# EAGLE design rapide328 (EAGLE 5.11)
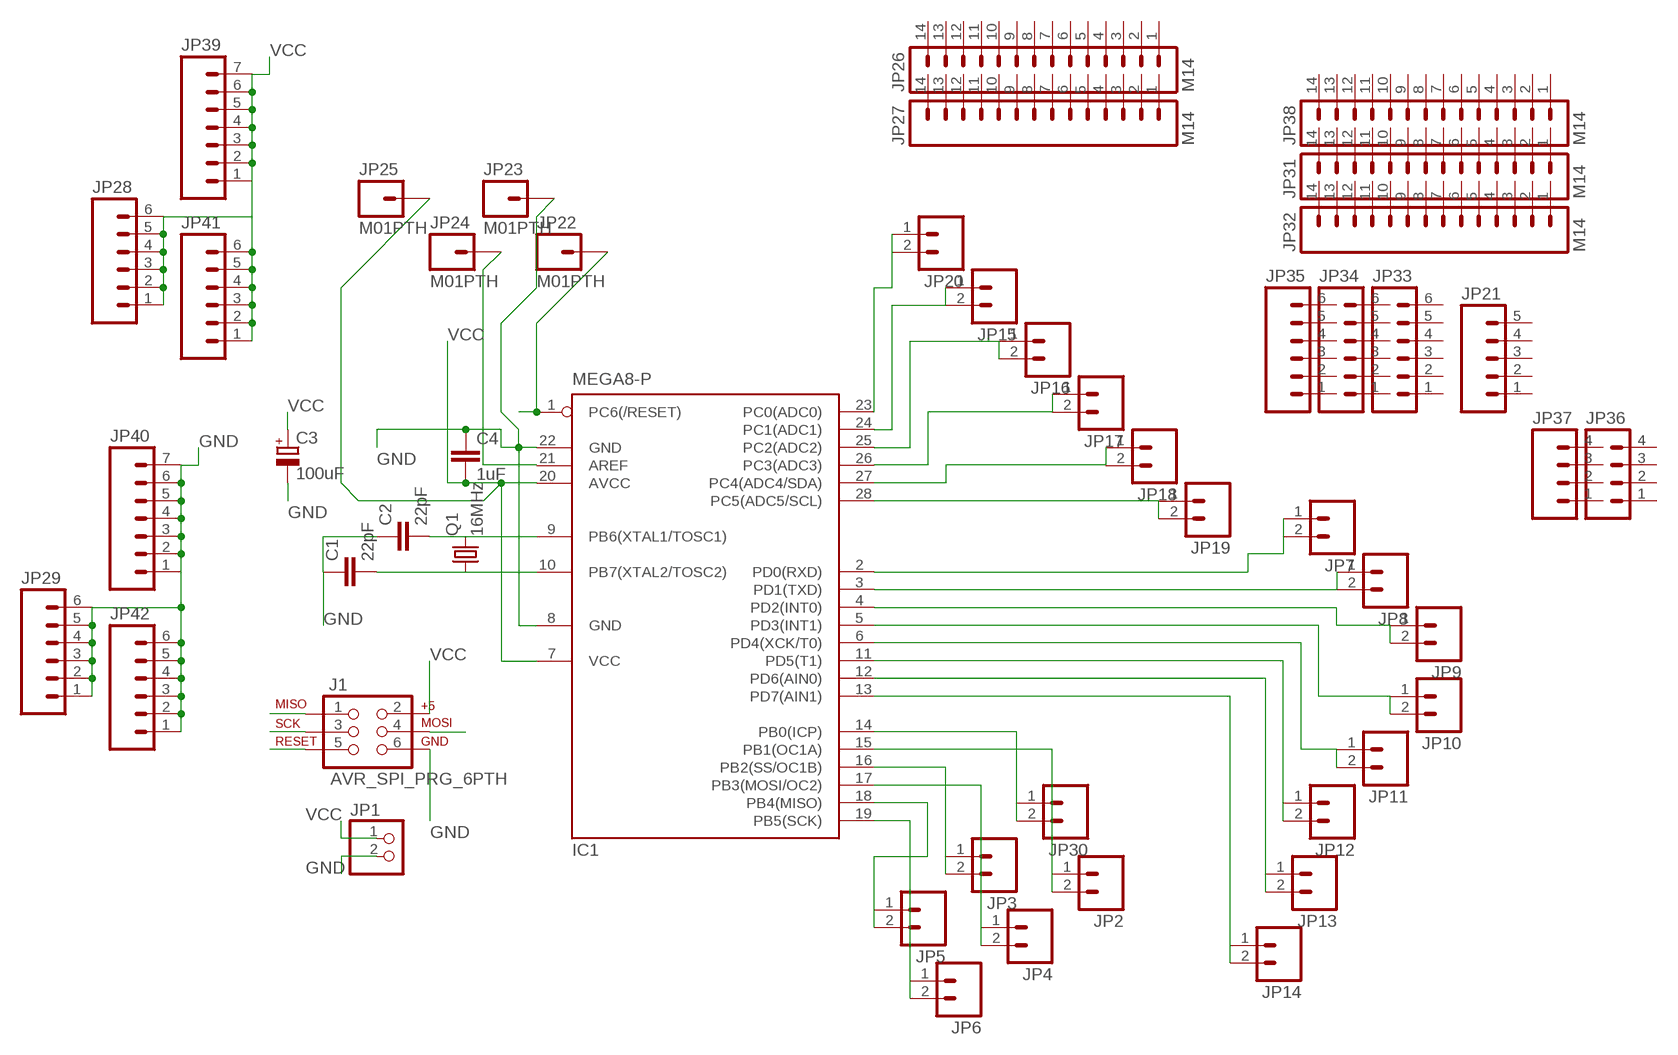
[diagram p0: schematic, sheet 1]

## Parts
C1  22pF  C-EU025-024X044  [C025-024X044]
C2  22pF  C-EU025-024X044  [C025-024X044]
C3  100uF  CPOL-EUE2.5-5  [E2,5-5]
C4  1uF  C-EU025-024X044  [C025-024X044]
IC1  MEGA8-P  [DIL28-3]
J1  AVR_SPI_PRG_6PTH  [2X3]
JP1  PINHD-1X2  [1X02]
JP2  M02LOCK  [1X02_LOCK]
JP3  M02LOCK  [1X02_LOCK]
JP4  M02LOCK  [1X02_LOCK]
JP5  M02LOCK  [1X02_LOCK]
JP6  M02LOCK  [1X02_LOCK]
JP7  M02LOCK  [1X02_LOCK]
JP8  M02LOCK  [1X02_LOCK]
JP9  M02LOCK  [1X02_LOCK]
JP10  M02LOCK  [1X02_LOCK]
JP11  M02LOCK  [1X02_LOCK]
JP12  M02LOCK  [1X02_LOCK]
JP13  M02LOCK  [1X02_LOCK]
JP14  M02LOCK  [1X02_LOCK]
JP15  M02LOCK  [1X02_LOCK]
JP16  M02LOCK  [1X02_LOCK]
JP17  M02LOCK  [1X02_LOCK]
JP18  M02LOCK  [1X02_LOCK]
JP19  M02LOCK  [1X02_LOCK]
JP20  M02LOCK  [1X02_LOCK]
JP21  M05PTH  [1X05]
JP22  M01PTH  [1X01]
JP23  M01PTH  [1X01]
JP24  M01PTH  [1X01]
JP25  M01PTH  [1X01]
JP26  M14  [1X14]
JP27  M14  [1X14]
JP28  M06SIP  [1X06]
JP29  M06SIP  [1X06]
JP30  M02LOCK  [1X02_LOCK]
JP31  M14  [1X14]
JP32  M14  [1X14]
JP33  M06SIP  [1X06]
JP34  M06SIP  [1X06]
JP35  M06SIP  [1X06]
JP36  M04PTH  [1X04]
JP37  M04PTH  [1X04]
JP38  M14  [1X14]
JP39  M07  [1X07]
JP40  M07  [1X07]
JP41  M06SIP  [1X06]
JP42  M06SIP  [1X06]
Q1  16MHz  CRYSTALHC49S  [HC49/S]

## Nets
GND: C1.1 C2.1 C3.- C4.1 IC1.8(GND) IC1.22(GND) J1.6 JP1.2 JP23.1 JP29.1 JP29.2 JP29.3 JP29.4 JP29.5 JP29.6 JP40.1 JP40.2 JP40.3 JP40.4 JP40.5 JP40.6 JP40.7 JP42.1 JP42.2 JP42.3 JP42.4 JP42.5 JP42.6
MISO: IC1.18(PB4(MISO)) J1.1 JP5.1 JP5.2
MOSI: IC1.17(PB3(MOSI/OC2)) J1.4 JP4.1 JP4.2
N$1: C1.2 IC1.10(PB7(XTAL2/TOSC2)) Q1.1
N$2: C2.2 IC1.9(PB6(XTAL1/TOSC1)) Q1.2
N$3: IC1.14(PB0(ICP)) JP30.1 JP30.2
N$4: IC1.15(PB1(OC1A)) JP2.1 JP2.2
N$5: IC1.16(PB2(SS/OC1B)) JP3.1 JP3.2
N$6: IC1.2(PD0(RXD)) JP7.1 JP7.2
N$7: IC1.3(PD1(TXD)) JP8.1 JP8.2
N$8: IC1.4(PD2(INT0)) JP9.1 JP9.2
N$9: IC1.27(PC4(ADC4/SDA)) JP18.1 JP18.2
N$10: IC1.28(PC5(ADC5/SCL)) JP19.1 JP19.2
N$11: IC1.26(PC3(ADC3)) JP17.1 JP17.2
N$12: IC1.5(PD3(INT1)) JP10.1 JP10.2
N$13: IC1.6(PD4(XCK/T0)) JP11.1 JP11.2
N$14: IC1.21(AREF) JP24.1
N$18: IC1.11(PD5(T1)) JP12.1 JP12.2
N$19: IC1.23(PC0(ADC0)) JP20.1 JP20.2
N$20: IC1.24(PC1(ADC1)) JP15.1 JP15.2
N$21: IC1.25(PC2(ADC2)) JP16.1 JP16.2
N$25: IC1.12(PD6(AIN0)) JP13.1 JP13.2
N$26: IC1.13(PD7(AIN1)) JP14.1 JP14.2
RESET: IC1.1(PC6(/RESET)) J1.5 JP22.1
SCK: IC1.19(PB5(SCK)) J1.3 JP6.1 JP6.2
VCC: C3.+ C4.2 IC1.7(VCC) IC1.20(AVCC) J1.2 JP1.1 JP25.1 JP28.1 JP28.2 JP28.3 JP28.4 JP28.5 JP28.6 JP39.1 JP39.2 JP39.3 JP39.4 JP39.5 JP39.6 JP39.7 JP41.1 JP41.2 JP41.3 JP41.4 JP41.5 JP41.6
Unconnected: JP21.1 JP21.2 JP21.3 JP21.4 JP21.5 JP26.1 JP26.2 JP26.3 JP26.4 JP26.5 JP26.6 JP26.7 JP26.8 JP26.9 JP26.10 JP26.11 JP26.12 JP26.13 JP26.14 JP27.1 JP27.2 JP27.3 JP27.4 JP27.5 JP27.6 JP27.7 JP27.8 JP27.9 JP27.10 JP27.11 JP27.12 JP27.13 JP27.14 JP31.1 JP31.2 JP31.3 JP31.4 JP31.5 JP31.6 JP31.7 JP31.8 JP31.9 JP31.10 JP31.11 JP31.12 JP31.13 JP31.14 JP32.1 JP32.2 JP32.3 JP32.4 JP32.5 JP32.6 JP32.7 JP32.8 JP32.9 JP32.10 JP32.11 JP32.12 JP32.13 JP32.14 JP33.1 JP33.2 JP33.3 JP33.4 JP33.5 JP33.6 JP34.1 JP34.2 JP34.3 JP34.4 JP34.5 JP34.6 JP35.1 JP35.2 JP35.3 JP35.4 JP35.5 JP35.6 JP36.1 JP36.2 JP36.3 JP36.4 JP37.1 JP37.2 JP37.3 JP37.4 JP38.1 JP38.2 JP38.3 JP38.4 JP38.5 JP38.6 JP38.7 JP38.8 JP38.9 JP38.10 JP38.11 JP38.12 JP38.13 JP38.14

## Library data of the parts
C1 C2 C4 = resistor:C-EU: CAPACITOR, European symbol
C3 = resistor:CPOL-EU: POLARIZED CAPACITOR, European symbol
IC1 = atmel:MEGA8-P: MICROCONTROLLER 8 Kbytes FLASH, 1 kbytes SRAM, 512 bytes EEPROM, USART, 4-channel 10 bit ADC, 2-channel 8 bit ADC Pin compatible with Atmega48, ATMega88, ATMega168 Source: avr.lbr; OC_FARNELL: unknown; OC_NEWARK: unknown
J1 = SparkFun:AVR_SPI_PRG_6: AVR ISP 6 Pin This is the reduced ISP connector for AVR programming. Common on Arduino. This footprint will take up less PCB space and can be used with a 10-pin to 6-pin adapter such as SKU: BOB-08508
JP1 = pinhead:PINHD-1X2: PIN HEADER
JP2-JP20 JP30 = SparkFun:M02: Header 2 Standard 2-pin 0.1" header. Use with straight break away headers (SKU : PRT-00116), right angle break away headers (PRT-00553), swiss pins (PRT-00743), machine pins (PRT-00117), and female headers (PRT-00115). Molex polarized connector foot print use with SKU : PRT-08233 with associated crimp pins and housings.
JP21 = SparkFun:M05: Header 5 Standard 5-pin 0.1" header. Use with straight break away headers (SKU : PRT-00116), right angle break away headers (PRT-00553), swiss pins (PRT-00743), machine pins (PRT-00117), and female headers (PRT-00115). Molex polarized connector foot print use with SKU : PRT-08230 with associated crimp pins and housings.
JP22-JP25 = SparkFun:M01: Header 1 Standard 1-pin 0.1" header. Use with straight break away headers (SKU : PRT-00116), right angle break away headers (PRT-00553), swiss pins (PRT-00743), machine pins (PRT-00117), and female headers (PRT-00115).
JP26 JP27 JP31 JP32 JP38 = SparkFun:M14: Header 14 Standard 14-pin 0.1" header. Use with straight break away headers (SKU : PRT-00116), right angle break away headers (PRT-00553), swiss pins (PRT-00743), machine pins (PRT-00117), and female headers (PRT-00115).
JP28 JP29 JP33-JP35 JP41 JP42 = SparkFun:M06: Header 6 Standard 6-pin 0.1" header. Use with straight break away headers (SKU : PRT-00116), right angle break away headers (PRT-00553), swiss pins (PRT-00743), machine pins (PRT-00117), and female headers (PRT-00115). Molex polarized connector foot print use with SKU : PRT-08094 with associated crimp pins and housings. NOTES ON THE VARIANTS LOCK and LOCK_LONGPADS... This footprint was designed to help hold the alignment of a through-hole component (i.e. 6-pin header) while soldering it into place. You may notice that each hole has been shifted either up or down by 0.005 of an inch from it's more standard position (which is a perfectly straight line). This slight alteration caused the pins (the squares in the middle) to touch the edges of the holes. Because they are alternating, it causes a "brace" to hold the component in place. 0.005 has proven to be the perfect amount of "off-center" position when using our standard breakaway headers. Although looks a little odd when you look at the bare footprint, once you have a header in there, the alteration is very hard to notice. Also, if you push a header all the way into place, it is covered up entirely on the bottom side. This idea of altering the position of holes to aid alignment will be further integrated into the Sparkfun Library for other footprints. It can help hold any component with 3 or more connection pins.
JP36 JP37 = SparkFun:M04: Header 4 Standard 4-pin 0.1" header. Use with straight break away headers (SKU : PRT-00116), right angle break away headers (PRT-00553), swiss pins (PRT-00743), machine pins (PRT-00117), and female headers (PRT-00115). Molex polarized connector foot print use with SKU : PRT-08231 with associated crimp pins and housings. 1MM SMD Version SKU: PRT-10208
JP39 JP40 = SparkFun:M07: Header 7 Standard 7-pin 0.1" header. Use with straight break away headers (SKU : PRT-00116), right angle break away headers (PRT-00553), swiss pins (PRT-00743), machine pins (PRT-00117), and female headers (PRT-00115). NOTES ON THE VARIANTS LOCK and LOCK_LONGPADS... This footprint was designed to help hold the alignment of a through-hole component (i.e. 7-pin header) while soldering it into place. You may notice that each hole has been shifted either up or down by 0.005 of an inch from it's more standard position (which is usually a perfectly straight line). This slight alteration caused the pins (the squares in the middle) to touch the edges of the holes. Because they are alternating, it causes a "brace" to hold the header in place. 0.005 has proven to be the perfect amount of "off-center" position when using our standard breakaway headers. Although looks a little odd when you look at the bare footprint, once you have a header in there, the alteration is very hard to notice. Also, if you push a header all the way into place, it is covered up entirely on the bottom side. This idea of altering the position of holes to aid alignment will be further integrated into the Sparkfun Library for other footprints. It can help hold any component with 3 or more connection pins.
Q1 = crystal:CRYSTAL: CRYSTAL; OC_FARNELL: 1667008; OC_NEWARK: unknown

## Board
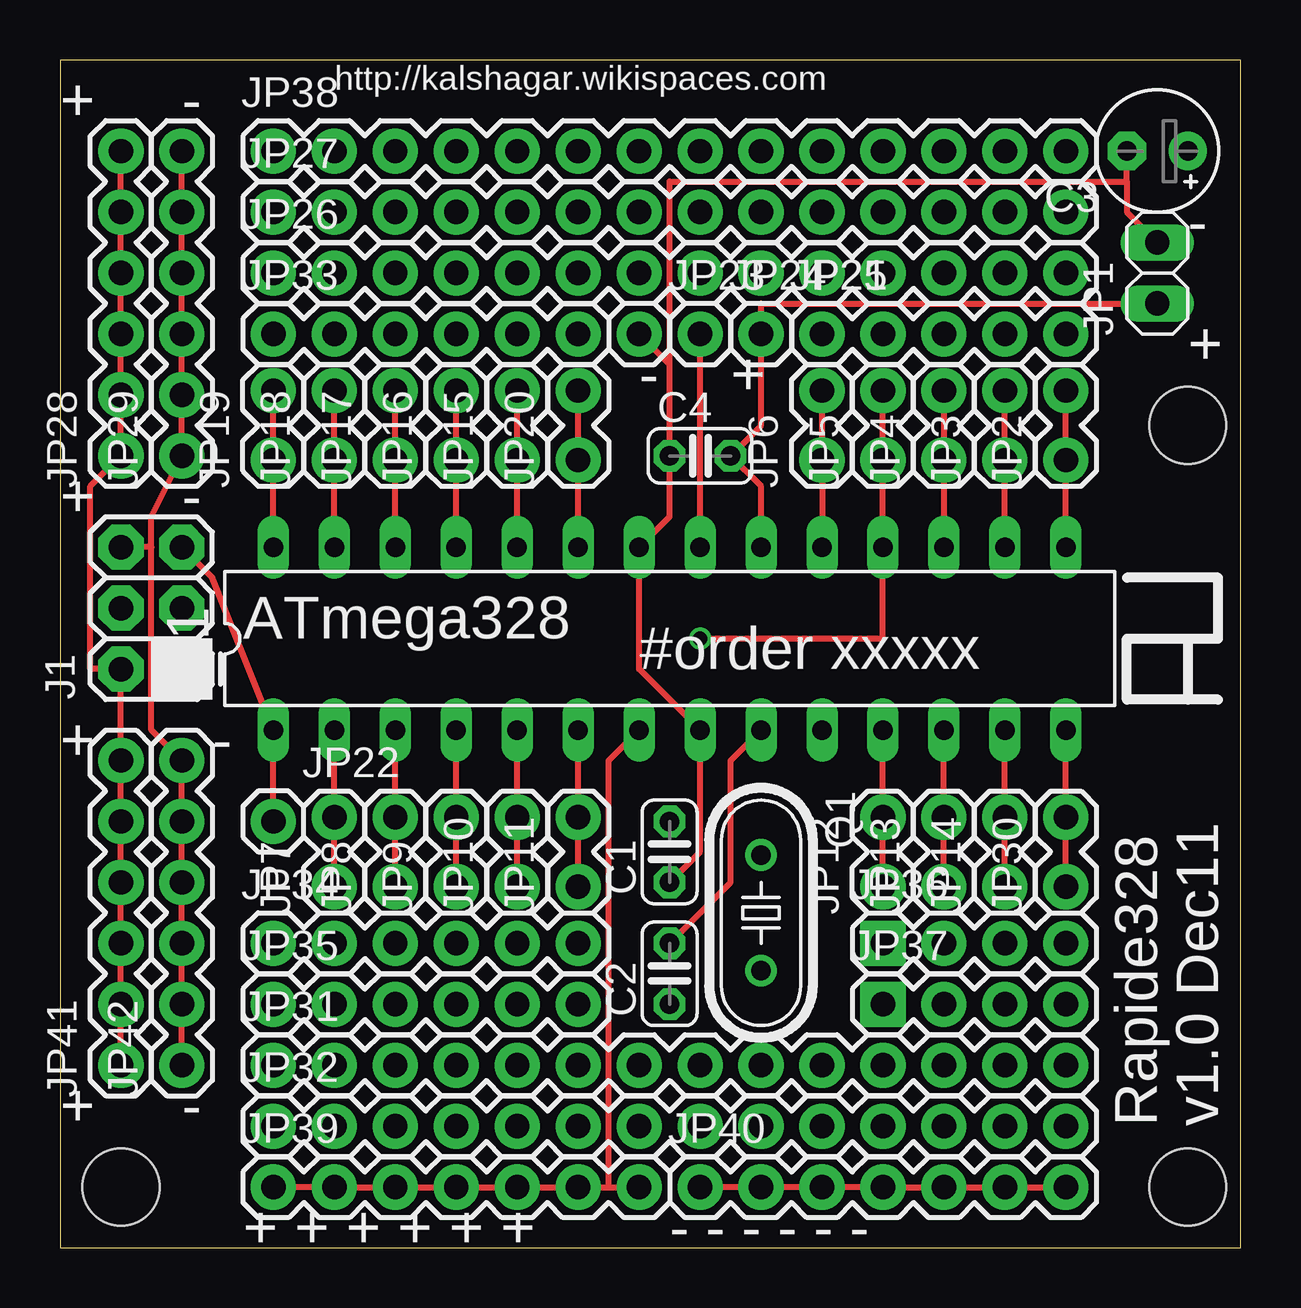
[diagram p1: board, top side]
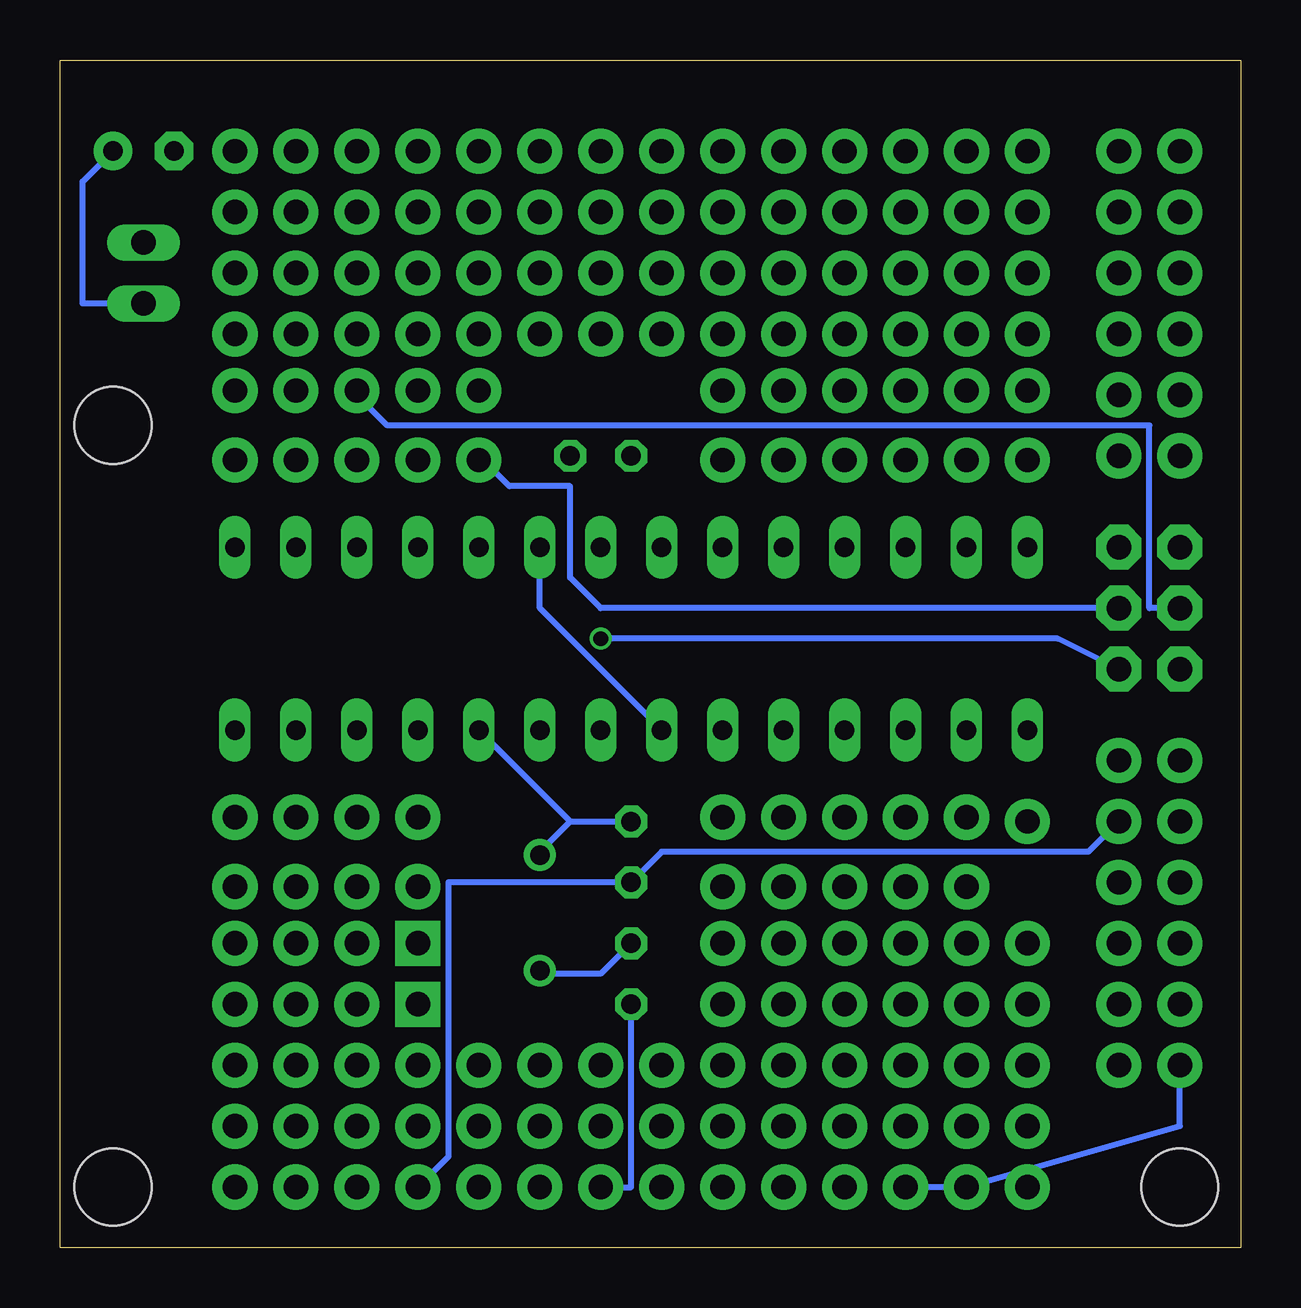
[diagram p2: board, bottom side, seen from below]

Size 49.2 x 49.52 mm. Coordinates in mm from the lower left corner, seen from the top.
Outline: 0,0 49.2,0 49.2,49.52 0,49.52 0,0
Copper layers (1*16): Top 0.035mm / dielectric 1.5mm / Bottom 0.035mm
Design rules "Fusion_eagle_rule_v1.1": minimum track width 6mil, minimum drill 12mil, track to track 6mil, track to pad 6mil, pad to pad 6mil, via to via 6mil, smd to smd 0mil, copper to edge 10mil, drill to drill 10mil, minimum pad ring 10mil, minimum via ring 6mil, stop-mask expansion 2mil, vias tented up to drill 100mil, thermal gap 10mil
Holes 3.2 mm at 46.99,2.54 46.99,34.29 2.54,2.54

### Footprints (pad centres in the part's own frame; a part is rotated, then mirrored left to right if it is on the bottom)
C025-024X044 = drill 0.813 octagon: 1 -1.27,0; 2 1.27,0
E2,5-5 = drill 0.813 pad 1.6 round: + -1.27,0 | drill 0.813 pad 1.6 octagon: - 1.27,0
DIL28-3 = drill 0.813 long: 1 -16.51,-3.81; 2 -13.97,-3.81; 3 -11.43,-3.81; 4 -8.89,-3.81; 5 -6.35,-3.81; 6 -3.81,-3.81; 7 -1.27,-3.81; 8 1.27,-3.81; 9 3.81,-3.81; 10 6.35,-3.81; 11 8.89,-3.81; 12 11.43,-3.81; 13 13.97,-3.81; 14 16.51,-3.81; 15 16.51,3.81; 16 13.97,3.81; 17 11.43,3.81; 18 8.89,3.81; 19 6.35,3.81; 20 3.81,3.81; 21 1.27,3.81; 22 -1.27,3.81; 23 -3.81,3.81; 24 -6.35,3.81; 25 -8.89,3.81; 26 -11.43,3.81; 27 -13.97,3.81; 28 -16.51,3.81
2X3 = drill 1.016 pad 1.88 octagon: 1 0,0; 2 0,2.54; 3 2.54,0; 4 2.54,2.54; 5 5.08,0; 6 5.08,2.54
1X02 = drill 1.016 long: 1 -1.27,0; 2 1.27,0
1X02_LOCK = drill 1.016 pad 1.88 round: 1 -0.178,0; 2 2.718,0
1X05 = drill 1.016 pad 1.88 round: 1 0,0; 2 2.54,0; 3 5.08,0; 4 7.62,0; 5 10.16,0
1X01 = drill 1.016 pad 1.88 round: 1 0,0
1X14 = drill 1.016 pad 1.88 round: 1 0,0; 2 2.54,0; 3 5.08,0; 4 7.62,0; 5 10.16,0; 6 12.7,0; 7 15.24,0; 8 17.78,0; 9 20.32,0; 10 22.86,0; 11 25.4,0; 12 27.94,0; 13 30.48,0; 14 33.02,0
1X06 = drill 1.016 pad 1.88 round: 1 0,0; 2 2.54,0; 3 5.08,0; 4 7.62,0; 5 10.16,0; 6 12.7,0
1X04 = drill 1.016 pad 1.88 square: 1 0,0 | drill 1.016 pad 1.88 round: 2 2.54,0; 3 5.08,0; 4 7.62,0
1X07 = drill 1.016 pad 1.88 round: 1 0,0; 2 2.54,0; 3 5.08,0; 4 7.62,0; 5 10.16,0; 6 12.7,0; 7 15.24,0
HC49/S = drill 0.813 round: 1 -2.413,0; 2 2.413,0

### Placement (x,y rotation side)
C1  25.4,16.51 90 top
C2  25.4,11.43 90 top
C3  45.72,45.72 180 top
C4  26.67,33.02 0 top
IC1  25.4,25.4 0 top
J1  5.08,24.13 90 top
JP1  45.72,40.64 90 top
JP2  41.91,33.02 90 top
JP3  39.37,33.02 90 top
JP4  36.83,33.02 90 top
JP5  34.29,33.02 90 top
JP6  31.75,33.02 90 top
JP7  11.43,15.24 90 top
JP8  13.97,15.24 90 top
JP9  16.51,15.24 90 top
JP10  19.05,15.24 90 top
JP11  21.59,15.24 90 top
JP12  34.29,15.24 90 top
JP13  36.83,15.24 90 top
JP14  39.37,15.24 90 top
JP15  19.05,33.02 90 top
JP16  16.51,33.02 90 top
JP17  13.97,33.02 90 top
JP18  11.43,33.02 90 top
JP19  8.89,33.02 90 top
JP20  21.59,33.02 90 top
JP21  31.75,38.1 0 top
JP22  8.89,17.78 0 top
JP23  24.13,38.1 0 top
JP24  26.67,38.1 0 top
JP25  29.21,38.1 0 top
JP26  8.89,40.64 0 top
JP27  8.89,43.18 0 top
JP28  2.54,33.02 90 top
JP29  5.08,33.02 90 top
JP30  41.91,15.24 90 top
JP31  8.89,7.62 0 top
JP32  8.89,5.08 0 top
JP33  8.89,38.1 0 top
JP34  8.89,12.7 0 top
JP35  8.89,10.16 0 top
JP36  34.29,12.7 0 top
JP37  34.29,10.16 0 top
JP38  8.89,45.72 0 top
JP39  8.89,2.54 0 top
JP40  26.67,2.54 0 top
JP41  2.54,7.62 90 top
JP42  5.08,7.62 90 top
Q1  29.21,13.97 270 top

### Tracks (layer width: path | path; a pad name or v marks a point on that pad's centre or on a via)
GND
  Top 0.254: JP42.1 JP42.2 JP42.3 JP42.4 JP42.5 JP42.6 3.81,21.59 3.81,29.21 | JP29.6 JP29.5 JP29.4 JP29.3 JP29.2 JP29.1 3.81,30.48 3.81,29.21 | 3.81,29.21 J1.6 | JP40.1 JP40.2 JP40.3 JP40.4 JP40.5 JP40.6 JP40.7 | C1.1 26.67,16.51 IC1.8 24.13,24.13 IC1.22 25.4,30.48 C4.1 25.4,36.83 | JP1.2 44.45,43.18 44.45,44.45 | 44.45,44.45 C3.- | 25.4,36.83 JP23.1 | 44.45,44.45 25.4,44.45 25.4,36.83
  Bottom 0.254: C2.1 25.4,2.54 JP40.1 | JP40.4 33.02,3.81 33.02,15.24 C1.1 24.13,16.51 6.35,16.51 JP42.5
MISO  (via drill 0.61)
  Top 0.254: JP5.2 JP5.1 IC1.18 34.29,25.4 v26.67,25.4
  Bottom 0.254: J1.1 7.62,25.4 v26.67,25.4
MOSI
  Top 0.254: IC1.17 JP4.1 JP4.2
  Bottom 0.254: J1.4 3.81,26.67 3.81,34.29 35.56,34.29 36.83,35.56 JP4.2
N$1
  Bottom 0.254: 27.94,17.78 29.21,16.51 Q1.1 | 27.94,17.78 C1.2 | 27.94,17.78 IC1.10
N$2
  Top 0.254: IC1.9 27.94,20.32 27.94,15.24 C2.2
  Bottom 0.254: C2.2 26.67,11.43 29.21,11.43 Q1.2
N$3
  Top 0.254: IC1.14 JP30.2 JP30.1
N$4
  Top 0.254: IC1.15 JP2.1 JP2.2
N$5
  Top 0.254: IC1.16 JP3.1 JP3.2
N$6
  Top 0.254: IC1.2 JP7.2 JP7.1
N$7
  Top 0.254: IC1.3 JP8.2 JP8.1
N$8
  Top 0.254: IC1.4 JP9.2 JP9.1
N$9
  Top 0.254: IC1.27 JP18.1 JP18.2
N$10
  Top 0.254: IC1.28 JP19.1 JP19.2
N$11
  Top 0.254: IC1.26 JP17.1 JP17.2
N$12
  Top 0.254: IC1.5 JP10.2 JP10.1
N$13
  Top 0.254: IC1.6 JP11.2 JP11.1
N$14
  Top 0.254: IC1.21 JP24.1
N$18
  Top 0.254: IC1.11 JP12.2 JP12.1
N$19
  Top 0.254: IC1.23 JP20.1 JP20.2
N$20
  Top 0.254: IC1.24 JP15.1 JP15.2
N$21
  Top 0.254: IC1.25 JP16.1 JP16.2
N$25
  Top 0.254: IC1.12 JP13.2 JP13.1
N$26
  Top 0.254: IC1.13 JP14.2 JP14.1
RESET
  Top 0.254: JP22.1 IC1.1 6.35,27.94 J1.5
SCK
  Top 0.254: IC1.19 JP6.1 JP6.2
  Bottom 0.254: J1.3 26.67,26.67 27.94,27.94 27.94,31.75 30.48,31.75 31.75,33.02 JP6.1
VCC
  Top 0.254: IC1.20 29.21,31.75 C4.2 29.21,34.29 JP25.1 29.21,39.37 JP1.1 | JP39.1 JP39.2 JP39.3 JP39.4 JP39.5 JP39.6 22.86,2.54 | 22.86,2.54 JP39.7 | JP28.6 JP28.5 JP28.4 JP28.3 JP28.2 JP28.1 1.27,31.75 1.27,24.13 J1.2 JP41.6 JP41.5 JP41.4 JP41.3 JP41.2 JP41.1 | IC1.7 22.86,20.32 22.86,2.54
  Bottom 0.254: IC1.7 29.21,26.67 IC1.20 | C3.+ 48.26,44.45 48.26,39.37 JP1.1 | JP39.3 JP39.2 2.54,5.08 JP41.1

### Text on the board
tPlace: http://kalshagar.wikispaces.com | + | - | - | + | - | + | + | - | ATmega328 | #order xxxxx | + | - | + | - | Rapide328 | v1.0 Dec11 | + + + + + + | - - - - - -